# EasyEDA schematic EasyEDA_project.json
TITLE: Soldering station with temperature control; REV: 1.0; Date: 2021-08-31; Sheet: 1/1; Drawn By: Bazan Michał; Company: Politechnika Rzeszowska
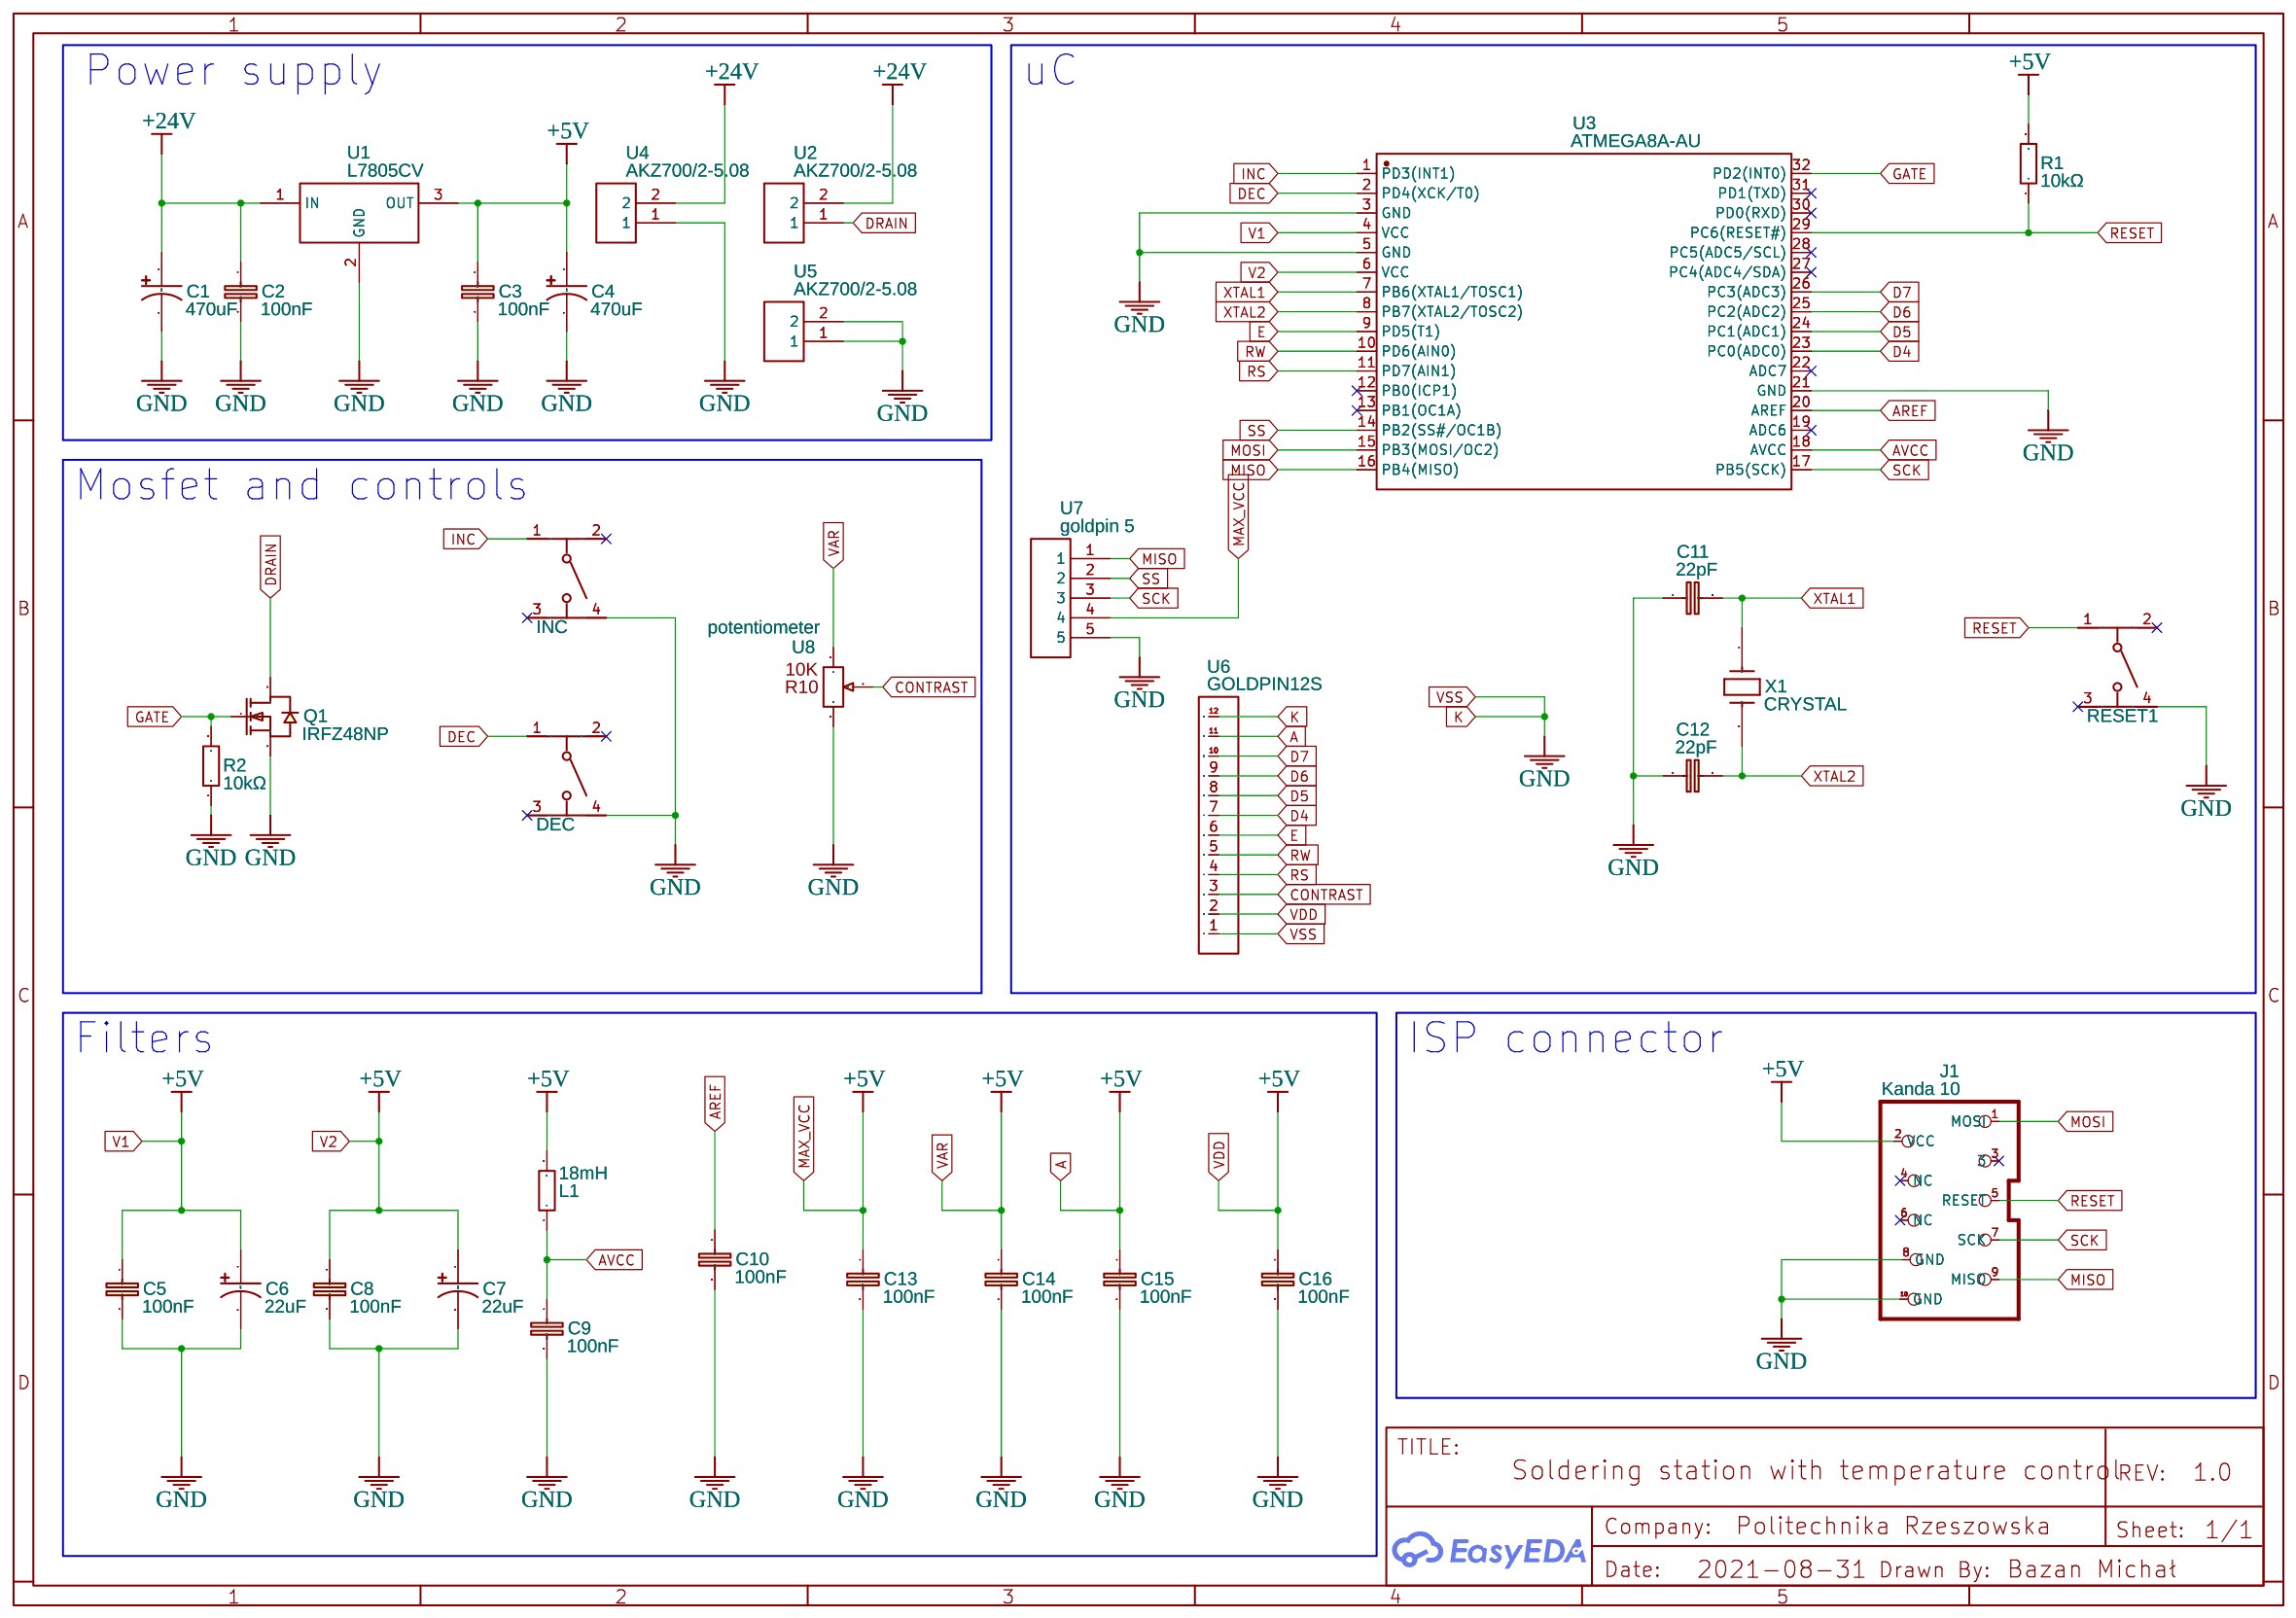
[diagram p0: schematic sheet]

## Parts
C1  470uF  [CAP-SMD_BD10.0-L10.3-W10.3-FD-1]
C2  100nF  [1206]
C3  100nF  [1206]
C4  470uF  [CAP-SMD_BD10.0-L10.3-W10.3-FD-1]
C5  100nF  [1206]
C6  22uF  [CAP-SMD_BD8.0-L8.3-W8.3-FD-LS9.9]
C7  22uF  [CAP-SMD_BD8.0-L8.3-W8.3-FD-LS9.9]
C8  100nF  [1206]
C9  100nF  [1206]
C10  100nF  [1206]
C11  22pF  [1206]
C12  22pF  [1206]
C13  100nF  [1206]
C14  100nF  [1206]
C15  100nF  [1206]
C16  100nF  [1206]
DEC  Switch-6x6x7.3-square-head  [SW-TH_4P-L6.0-W6.0-P4.50-LS6.5]
INC  Switch-6x6x7.3-square-head  [SW-TH_4P-L6.0-W6.0-P4.50-LS6.5]
J1  Kanda 10  [M2X5]
L1  18mH  [RES-TH_BD4.0-L11.5-P15.50-D0.7]
Q1  IRFZ48NP  [TO-220AB-3_L10.4-W4.6-P2.54-L]
R1  10kΩ  [1206]
R2  10kΩ  [1206]
RESET1  Switch-6x6x7.3-square-head  [SW-TH_4P-L6.0-W6.0-P4.50-LS6.5]
U1  L7805CV  [TO-220-3_L10.0-W4.5-P2.54-L]
U2  AKZ700/2-5.08  [AKZ700/2-5.08]
U3  ATMEGA8A-AU  [TQFP-32_L7.0-W7.0-P0.80-LS9.0-BL]
U4  AKZ700/2-5.08  [AKZ700/2-5.08]
U5  AKZ700/2-5.08  [AKZ700/2-5.08]
U6  GOLDPIN12S  [GOLDPIN12]
U7  goldpin 5  [5 GOLDPIN]
U8  potentiometer  [POTENTIOMETER]
X1  CRYSTAL  [XTAL1]

## Library data of the parts
C1 C4 = UWD1E471MCL1GS: Supplier: LCSC; Supplier Part: C251022; Manufacturer: Nichicon; Contributor: LCSC; JLCPCB Part Class: Extended Part
C2 C3 C5 C8-C16 = CAP1206: Capacitor; Contributor: SparkFun
C6 C7 = EEHZC1K220P: Supplier: LCSC; Supplier Part: C178647; Manufacturer: PANASONIC; Contributor: LCSC; JLCPCB Part Class: Extended Part
DEC INC RESET1 = Switch-6x6x7.3-square-head: Supplier Part: C71843; Supplier: LCSC; Manufacturer: BBJ; Manufacturer Part: Switch,6*6*7.3Plastic square head,260G, 0.25mm,Straight line
J1 = Kanda 10: 2x05 pin header; Contributor: DangerousPrototype; sourceId: FZ70icuM4
L1 = 1623925-3: Supplier: LCSC; Supplier Part: C306261; Manufacturer: TE Connectivity; Contributor: LCSC; LCSC Assembly: Yes; SMT Type: Extend
Q1 = IRFZ48NP: Supplier: LCSC; Supplier Part: C878808; Manufacturer: VBsemi Elec; Contributor: LCSC; JLCPCB Part Class: Extended Part
R1 R2 = 27KΩ: Supplier Part: undefined; Supplier: LCSC; Manufacturer Part: RTT062702FTP
U1 = L7805CV: Supplier: LCSC; Manufacturer: STMicroelectronics; Supplier Part: C111887; LCSC Assembly: Yes; SMT Type: Extend
U2 U4 U5 = AKZ700/2-5.08: Manufacturer: PTR; Contributor: AmazedWolf900
U3 = ATMEGA8A-AU: Supplier: LCSC; Manufacturer: MICROCHIP; image: //image.lceda.cn/szlcsc/C16190.jpg; Supplier Part: C16190; SMT Type: Extend; JLCPCB SMD: Yes
U6 = GOLDPIN12S: Manufacturer Part: New SchematicLib; Contributor: waldemarmariusz2
U7 = goldpin 5: Contributor: kamilopa6
U8 = potentiometer: Contributor: sausnet 1975
X1 = CRYSTAL: Contributor: deg87

## Nets
+5V: C3.1 C4.1 C5.1 C6.1 C7.1 C8.1 C13.1 C14.1 C15.1 C16.1 J1.2(VCC) L1.2 R1.2 U1.3(OUT) U3.4(VCC) U3.6(VCC) U6.2 U6.11 U7.4 U8.1
+24V: C1.1 C2.1 U1.1(IN) U2.2 U4.2
AVCC: C9.1 L1.1 U3.18(AVCC)
GND: C1.2 C2.2 C3.2 C4.2 C5.2 C6.2 C7.2 C8.2 C9.2 C10.2 C11.1 C12.2 C13.2 C14.2 C15.2 C16.2 DEC.4 INC.4 J1.8(GND) J1.10(GND) Q1.3(S) R2.1 RESET1.4 U1.2(GND) U3.3(GND) U3.5(GND) U3.21(GND) U4.1 U5.1 U5.2 U6.1 U6.12 U7.5 U8.3
AREF: C10.1 U3.20(AREF)
CONTRAST: U6.3 U8.2
D4: U3.23(PC0(ADC0)) U6.7
D5: U3.24(PC1(ADC1)) U6.8
D6: U3.25(PC2(ADC2)) U6.9
D7: U3.26(PC3(ADC3)) U6.10
DEC: DEC.1 U3.2(PD4(XCK/T0))
DRAIN: Q1.2(D) U2.1
E: U3.9(PD5(T1)) U6.6
GATE: Q1.1(G) R2.2 U3.32(PD2(INT0))
INC: INC.1 U3.1(PD3(INT1))
MISO: J1.9(MISO) U3.16(PB4(MISO)) U7.1
MOSI: J1.1(MOSI) U3.15(PB3(MOSI/OC2))
RESET: J1.5(RESET) R1.1 RESET1.1 U3.29(PC6(RESET#))
RS: U3.11(PD7(AIN1)) U6.4
RW: U3.10(PD6(AIN0)) U6.5
SCK: J1.7(SCK) U3.17(PB5(SCK)) U7.3
SS: U3.14(PB2(SS#/OC1B)) U7.2
XTAL1: C11.2 U3.7(PB6(XTAL1/TOSC1)) X1.1
XTAL2: C12.1 U3.8(PB7(XTAL2/TOSC2)) X1.2

Not connected (* = marked no-connect by the designer): DEC 2* 3*; INC 2* 3*; J1 3* 4(NC)* 6(NC)*; RESET1 2* 3*; U3 12(PB0(ICP1))* 13(PB1(OC1A))* 19(ADC6)* 22(ADC7)* 27(PC4(ADC4/SDA))* 28(PC5(ADC5/SCL))* 30(PD0(RXD))* 31(PD1(TXD))*

## Notes on the sheet
- Power supply
- uC
- Mosfet and controls
- Filters
- ISP connector
